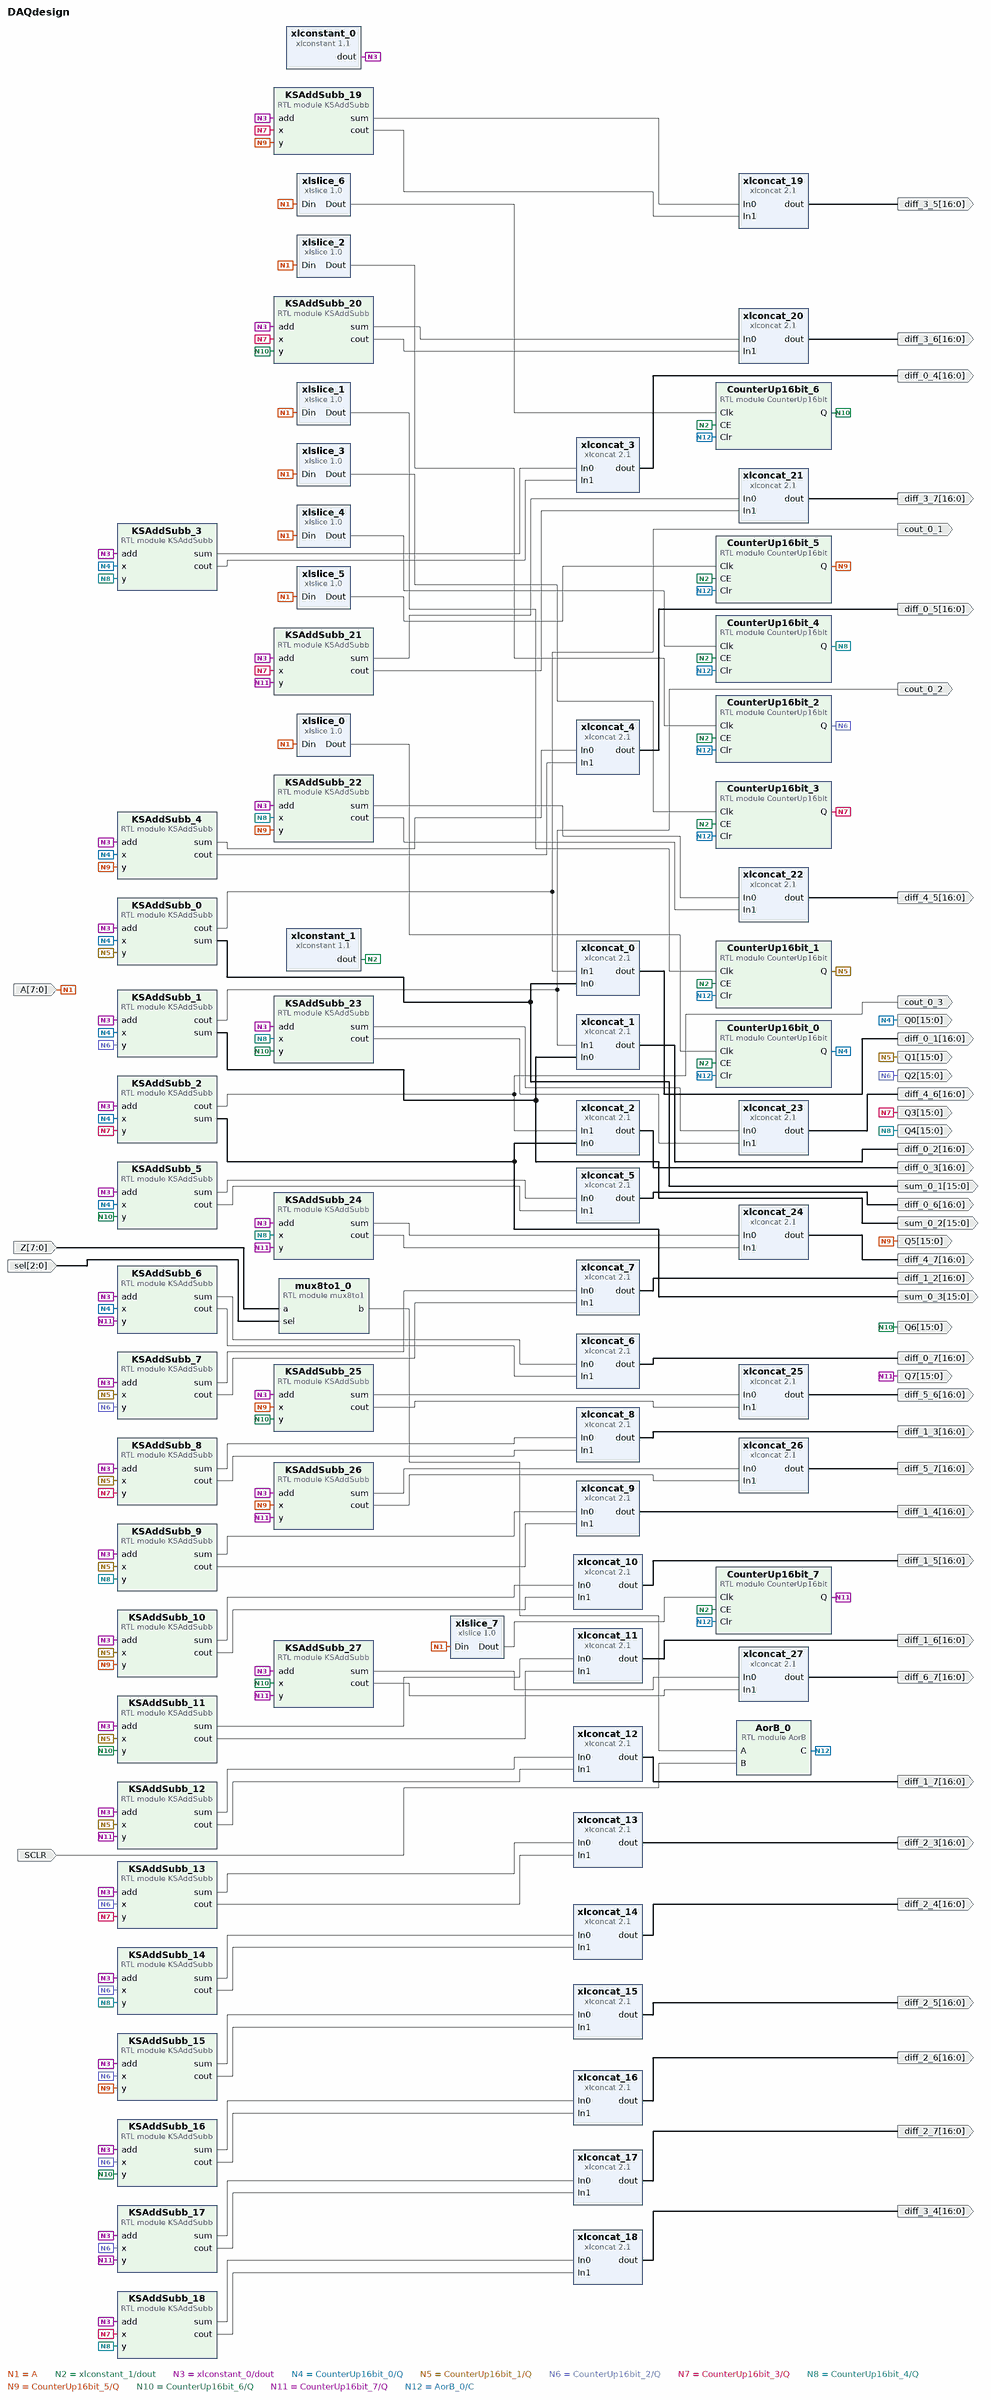
[diagram p0: block diagram of the top level]
# Vivado block design DAQdesign, xc7z020clg400-1, Vivado 2020.1
create_bd_design DAQdesign

create_bd_port -dir O -from 15 -to 0 -type data Q0
create_bd_port -dir O -from 15 -to 0 -type data Q1
create_bd_port -dir O -from 15 -to 0 -type data Q2
create_bd_port -dir O -from 15 -to 0 -type data Q3
create_bd_port -dir I -from 2 -to 0 -type data sel
create_bd_port -dir O -from 15 -to 0 -type data Q4
create_bd_port -dir O -from 15 -to 0 -type data Q5
create_bd_port -dir O -from 15 -to 0 -type data Q6
create_bd_port -dir O -from 15 -to 0 -type data Q7
create_bd_port -dir I -from 7 -to 0 -type rst Z
set_property -dict {CONFIG.POLARITY ACTIVE_HIGH} [get_bd_ports Z]
create_bd_port -dir I -from 7 -to 0 A
create_bd_port -dir O -from 16 -to 0 -type data diff_1_2
create_bd_port -dir O -from 16 -to 0 -type data diff_1_3
create_bd_port -dir O -from 16 -to 0 -type data diff_1_4
create_bd_port -dir O -from 16 -to 0 -type data diff_1_5
create_bd_port -dir O -from 16 -to 0 -type data diff_1_6
create_bd_port -dir O -from 16 -to 0 -type data diff_1_7
create_bd_port -dir O -from 16 -to 0 -type data diff_2_3
create_bd_port -dir O -from 16 -to 0 -type data diff_2_4
create_bd_port -dir O -from 16 -to 0 -type data diff_2_5
create_bd_port -dir O -from 16 -to 0 -type data diff_2_6
create_bd_port -dir O -from 16 -to 0 -type data diff_2_7
create_bd_port -dir O -from 16 -to 0 -type data diff_3_4
create_bd_port -dir O -from 16 -to 0 -type data diff_3_5
create_bd_port -dir O -from 16 -to 0 -type data diff_3_6
create_bd_port -dir O -from 16 -to 0 -type data diff_3_7
create_bd_port -dir O -from 16 -to 0 -type data diff_4_5
create_bd_port -dir O -from 16 -to 0 -type data diff_4_6
create_bd_port -dir O -from 16 -to 0 -type data diff_4_7
create_bd_port -dir O -from 16 -to 0 -type data diff_5_6
create_bd_port -dir O -from 16 -to 0 -type data diff_5_7
create_bd_port -dir O -from 16 -to 0 -type data diff_6_7
create_bd_port -dir O -from 16 -to 0 -type data diff_0_1
create_bd_port -dir O -from 16 -to 0 -type data diff_0_2
create_bd_port -dir O -from 16 -to 0 -type data diff_0_3
create_bd_port -dir O -from 16 -to 0 -type data diff_0_4
create_bd_port -dir O -from 16 -to 0 -type data diff_0_5
create_bd_port -dir O -from 16 -to 0 -type data diff_0_6
create_bd_port -dir O -from 16 -to 0 -type data diff_0_7
create_bd_port -dir I -type rst SCLR
set_property -dict {CONFIG.POLARITY ACTIVE_HIGH} [get_bd_ports SCLR]
create_bd_port -dir O -from 15 -to 0 -type data sum_0_1
create_bd_port -dir O -type data cout_0_1
create_bd_port -dir O -from 15 -to 0 -type data sum_0_2
create_bd_port -dir O -type data cout_0_2
create_bd_port -dir O -from 15 -to 0 -type data sum_0_3
create_bd_port -dir O cout_0_3

create_bd_cell -type ip -vlnv xilinx.com:ip:xlslice:1.0 xlslice_0
set_property -dict {CONFIG.DIN_WIDTH 8} [get_bd_cells xlslice_0]
create_bd_cell -type ip -vlnv xilinx.com:ip:xlslice:1.0 xlslice_4
set_property -dict {CONFIG.DIN_FROM 4 CONFIG.DIN_TO 4 CONFIG.DIN_WIDTH 8 CONFIG.DOUT_WIDTH 1} [get_bd_cells xlslice_4]
create_bd_cell -type ip -vlnv xilinx.com:ip:xlslice:1.0 xlslice_5
set_property -dict {CONFIG.DIN_FROM 5 CONFIG.DIN_TO 5 CONFIG.DIN_WIDTH 8 CONFIG.DOUT_WIDTH 1} [get_bd_cells xlslice_5]
create_bd_cell -type ip -vlnv xilinx.com:ip:xlslice:1.0 xlslice_6
set_property -dict {CONFIG.DIN_FROM 6 CONFIG.DIN_TO 6 CONFIG.DIN_WIDTH 8 CONFIG.DOUT_WIDTH 1} [get_bd_cells xlslice_6]
create_bd_cell -type ip -vlnv xilinx.com:ip:xlslice:1.0 xlslice_7
set_property -dict {CONFIG.DIN_FROM 7 CONFIG.DIN_TO 7 CONFIG.DIN_WIDTH 8 CONFIG.DOUT_WIDTH 1} [get_bd_cells xlslice_7]
create_bd_cell -type module -reference mux8to1 mux8to1_0
create_bd_cell -type ip -vlnv xilinx.com:ip:xlconstant:1.1 xlconstant_0
set_property -dict {CONFIG.CONST_VAL 0b1} [get_bd_cells xlconstant_0]
create_bd_cell -type ip -vlnv xilinx.com:ip:xlslice:1.0 xlslice_3
set_property -dict {CONFIG.DIN_FROM 3 CONFIG.DIN_TO 3 CONFIG.DIN_WIDTH 8 CONFIG.DOUT_WIDTH 1} [get_bd_cells xlslice_3]
create_bd_cell -type ip -vlnv xilinx.com:ip:xlslice:1.0 xlslice_2
set_property -dict {CONFIG.DIN_FROM 2 CONFIG.DIN_TO 2 CONFIG.DIN_WIDTH 8 CONFIG.DOUT_WIDTH 1} [get_bd_cells xlslice_2]
create_bd_cell -type ip -vlnv xilinx.com:ip:xlslice:1.0 xlslice_1
set_property -dict {CONFIG.DIN_FROM 1 CONFIG.DIN_TO 1 CONFIG.DIN_WIDTH 8 CONFIG.DOUT_WIDTH 1} [get_bd_cells xlslice_1]
create_bd_cell -type ip -vlnv xilinx.com:ip:xlconstant:1.1 xlconstant_1
set_property -dict {CONFIG.CONST_VAL 0b0} [get_bd_cells xlconstant_1]
create_bd_cell -type ip -vlnv xilinx.com:ip:xlconcat:2.1 xlconcat_0
set_property -dict {CONFIG.IN0_WIDTH 16 CONFIG.IN1_WIDTH 1} [get_bd_cells xlconcat_0]
create_bd_cell -type ip -vlnv xilinx.com:ip:xlconcat:2.1 xlconcat_1
set_property -dict {CONFIG.IN0_WIDTH 16 CONFIG.IN1_WIDTH 1} [get_bd_cells xlconcat_1]
create_bd_cell -type ip -vlnv xilinx.com:ip:xlconcat:2.1 xlconcat_2
set_property -dict {CONFIG.IN0_WIDTH 16 CONFIG.IN1_WIDTH 1} [get_bd_cells xlconcat_2]
create_bd_cell -type ip -vlnv xilinx.com:ip:xlconcat:2.1 xlconcat_3
set_property -dict {CONFIG.IN0_WIDTH 16 CONFIG.IN1_WIDTH 1} [get_bd_cells xlconcat_3]
create_bd_cell -type ip -vlnv xilinx.com:ip:xlconcat:2.1 xlconcat_4
set_property -dict {CONFIG.IN0_WIDTH 16 CONFIG.IN1_WIDTH 1} [get_bd_cells xlconcat_4]
create_bd_cell -type ip -vlnv xilinx.com:ip:xlconcat:2.1 xlconcat_5
set_property -dict {CONFIG.IN0_WIDTH 16 CONFIG.IN1_WIDTH 1} [get_bd_cells xlconcat_5]
create_bd_cell -type ip -vlnv xilinx.com:ip:xlconcat:2.1 xlconcat_6
set_property -dict {CONFIG.IN0_WIDTH 16 CONFIG.IN1_WIDTH 1} [get_bd_cells xlconcat_6]
create_bd_cell -type ip -vlnv xilinx.com:ip:xlconcat:2.1 xlconcat_7
set_property -dict {CONFIG.IN0_WIDTH 16 CONFIG.IN1_WIDTH 1} [get_bd_cells xlconcat_7]
create_bd_cell -type ip -vlnv xilinx.com:ip:xlconcat:2.1 xlconcat_8
set_property -dict {CONFIG.IN0_WIDTH 16 CONFIG.IN1_WIDTH 1} [get_bd_cells xlconcat_8]
create_bd_cell -type ip -vlnv xilinx.com:ip:xlconcat:2.1 xlconcat_9
set_property -dict {CONFIG.IN0_WIDTH 16 CONFIG.IN1_WIDTH 1} [get_bd_cells xlconcat_9]
create_bd_cell -type ip -vlnv xilinx.com:ip:xlconcat:2.1 xlconcat_10
set_property -dict {CONFIG.IN0_WIDTH 16 CONFIG.IN1_WIDTH 1} [get_bd_cells xlconcat_10]
create_bd_cell -type ip -vlnv xilinx.com:ip:xlconcat:2.1 xlconcat_11
set_property -dict {CONFIG.IN0_WIDTH 16 CONFIG.IN1_WIDTH 1} [get_bd_cells xlconcat_11]
create_bd_cell -type ip -vlnv xilinx.com:ip:xlconcat:2.1 xlconcat_12
set_property -dict {CONFIG.IN0_WIDTH 16 CONFIG.IN1_WIDTH 1} [get_bd_cells xlconcat_12]
create_bd_cell -type ip -vlnv xilinx.com:ip:xlconcat:2.1 xlconcat_13
set_property -dict {CONFIG.IN0_WIDTH 16 CONFIG.IN1_WIDTH 1} [get_bd_cells xlconcat_13]
create_bd_cell -type ip -vlnv xilinx.com:ip:xlconcat:2.1 xlconcat_14
set_property -dict {CONFIG.IN0_WIDTH 16 CONFIG.IN1_WIDTH 1} [get_bd_cells xlconcat_14]
create_bd_cell -type ip -vlnv xilinx.com:ip:xlconcat:2.1 xlconcat_15
set_property -dict {CONFIG.IN0_WIDTH 16 CONFIG.IN1_WIDTH 1} [get_bd_cells xlconcat_15]
create_bd_cell -type ip -vlnv xilinx.com:ip:xlconcat:2.1 xlconcat_16
set_property -dict {CONFIG.IN0_WIDTH 16 CONFIG.IN1_WIDTH 1} [get_bd_cells xlconcat_16]
create_bd_cell -type ip -vlnv xilinx.com:ip:xlconcat:2.1 xlconcat_17
set_property -dict {CONFIG.IN0_WIDTH 16 CONFIG.IN1_WIDTH 1} [get_bd_cells xlconcat_17]
create_bd_cell -type ip -vlnv xilinx.com:ip:xlconcat:2.1 xlconcat_18
set_property -dict {CONFIG.IN0_WIDTH 16 CONFIG.IN1_WIDTH 1} [get_bd_cells xlconcat_18]
create_bd_cell -type ip -vlnv xilinx.com:ip:xlconcat:2.1 xlconcat_19
set_property -dict {CONFIG.IN0_WIDTH 16 CONFIG.IN1_WIDTH 1} [get_bd_cells xlconcat_19]
create_bd_cell -type ip -vlnv xilinx.com:ip:xlconcat:2.1 xlconcat_20
set_property -dict {CONFIG.IN0_WIDTH 16 CONFIG.IN1_WIDTH 1} [get_bd_cells xlconcat_20]
create_bd_cell -type ip -vlnv xilinx.com:ip:xlconcat:2.1 xlconcat_21
set_property -dict {CONFIG.IN0_WIDTH 16 CONFIG.IN1_WIDTH 1} [get_bd_cells xlconcat_21]
create_bd_cell -type ip -vlnv xilinx.com:ip:xlconcat:2.1 xlconcat_22
set_property -dict {CONFIG.IN0_WIDTH 16 CONFIG.IN1_WIDTH 1} [get_bd_cells xlconcat_22]
create_bd_cell -type ip -vlnv xilinx.com:ip:xlconcat:2.1 xlconcat_23
set_property -dict {CONFIG.IN0_WIDTH 16 CONFIG.IN1_WIDTH 1} [get_bd_cells xlconcat_23]
create_bd_cell -type ip -vlnv xilinx.com:ip:xlconcat:2.1 xlconcat_24
set_property -dict {CONFIG.IN0_WIDTH 16 CONFIG.IN1_WIDTH 1} [get_bd_cells xlconcat_24]
create_bd_cell -type ip -vlnv xilinx.com:ip:xlconcat:2.1 xlconcat_25
set_property -dict {CONFIG.IN0_WIDTH 16 CONFIG.IN1_WIDTH 1} [get_bd_cells xlconcat_25]
create_bd_cell -type ip -vlnv xilinx.com:ip:xlconcat:2.1 xlconcat_26
set_property -dict {CONFIG.IN0_WIDTH 16 CONFIG.IN1_WIDTH 1} [get_bd_cells xlconcat_26]
create_bd_cell -type ip -vlnv xilinx.com:ip:xlconcat:2.1 xlconcat_27
set_property -dict {CONFIG.IN0_WIDTH 16 CONFIG.IN1_WIDTH 1} [get_bd_cells xlconcat_27]
create_bd_cell -type module -reference CounterUp16bit CounterUp16bit_0
create_bd_cell -type module -reference CounterUp16bit CounterUp16bit_1
create_bd_cell -type module -reference CounterUp16bit CounterUp16bit_2
create_bd_cell -type module -reference CounterUp16bit CounterUp16bit_3
create_bd_cell -type module -reference CounterUp16bit CounterUp16bit_4
create_bd_cell -type module -reference CounterUp16bit CounterUp16bit_5
create_bd_cell -type module -reference CounterUp16bit CounterUp16bit_6
create_bd_cell -type module -reference CounterUp16bit CounterUp16bit_7
create_bd_cell -type module -reference AorB AorB_0
create_bd_cell -type module -reference KSAddSubb KSAddSubb_0
create_bd_cell -type module -reference KSAddSubb KSAddSubb_13
create_bd_cell -type module -reference KSAddSubb KSAddSubb_14
create_bd_cell -type module -reference KSAddSubb KSAddSubb_15
create_bd_cell -type module -reference KSAddSubb KSAddSubb_16
create_bd_cell -type module -reference KSAddSubb KSAddSubb_17
create_bd_cell -type module -reference KSAddSubb KSAddSubb_18
create_bd_cell -type module -reference KSAddSubb KSAddSubb_19
create_bd_cell -type module -reference KSAddSubb KSAddSubb_20
create_bd_cell -type module -reference KSAddSubb KSAddSubb_21
create_bd_cell -type module -reference KSAddSubb KSAddSubb_1
create_bd_cell -type module -reference KSAddSubb KSAddSubb_22
create_bd_cell -type module -reference KSAddSubb KSAddSubb_23
create_bd_cell -type module -reference KSAddSubb KSAddSubb_24
create_bd_cell -type module -reference KSAddSubb KSAddSubb_25
create_bd_cell -type module -reference KSAddSubb KSAddSubb_26
create_bd_cell -type module -reference KSAddSubb KSAddSubb_27
create_bd_cell -type module -reference KSAddSubb KSAddSubb_2
create_bd_cell -type module -reference KSAddSubb KSAddSubb_3
create_bd_cell -type module -reference KSAddSubb KSAddSubb_4
create_bd_cell -type module -reference KSAddSubb KSAddSubb_5
create_bd_cell -type module -reference KSAddSubb KSAddSubb_6
create_bd_cell -type module -reference KSAddSubb KSAddSubb_7
create_bd_cell -type module -reference KSAddSubb KSAddSubb_8
create_bd_cell -type module -reference KSAddSubb KSAddSubb_9
create_bd_cell -type module -reference KSAddSubb KSAddSubb_10
create_bd_cell -type module -reference KSAddSubb KSAddSubb_11
create_bd_cell -type module -reference KSAddSubb KSAddSubb_12

# ---- connections ----

connect_bd_net -net clk_1 [get_bd_ports A] \
  [get_bd_pins xlslice_0/Din] [get_bd_pins xlslice_4/Din] [get_bd_pins xlslice_5/Din] [get_bd_pins xlslice_6/Din] \
  [get_bd_pins xlslice_7/Din] [get_bd_pins xlslice_3/Din] [get_bd_pins xlslice_2/Din] [get_bd_pins xlslice_1/Din]
connect_bd_net [get_bd_ports Z] [get_bd_pins mux8to1_0/a]
connect_bd_net [get_bd_ports sel] [get_bd_pins mux8to1_0/sel]
connect_bd_net [get_bd_pins xlslice_1/Dout] [get_bd_pins CounterUp16bit_1/Clk]
connect_bd_net [get_bd_pins mux8to1_0/b] [get_bd_pins AorB_0/A]
connect_bd_net [get_bd_pins xlslice_0/Dout] [get_bd_pins CounterUp16bit_0/Clk]
connect_bd_net [get_bd_pins xlslice_2/Dout] [get_bd_pins CounterUp16bit_2/Clk]
connect_bd_net [get_bd_pins xlslice_3/Dout] [get_bd_pins CounterUp16bit_3/Clk]
connect_bd_net [get_bd_pins xlslice_4/Dout] [get_bd_pins CounterUp16bit_4/Clk]
connect_bd_net [get_bd_pins xlslice_5/Dout] [get_bd_pins CounterUp16bit_5/Clk]
connect_bd_net [get_bd_pins xlslice_6/Dout] [get_bd_pins CounterUp16bit_6/Clk]
connect_bd_net [get_bd_pins xlslice_7/Dout] [get_bd_pins CounterUp16bit_7/Clk]
connect_bd_net [get_bd_pins xlconstant_1/dout] \
  [get_bd_pins CounterUp16bit_0/CE] [get_bd_pins CounterUp16bit_1/CE] [get_bd_pins CounterUp16bit_2/CE] \
  [get_bd_pins CounterUp16bit_3/CE] [get_bd_pins CounterUp16bit_4/CE] [get_bd_pins CounterUp16bit_5/CE] \
  [get_bd_pins CounterUp16bit_6/CE] [get_bd_pins CounterUp16bit_7/CE]
connect_bd_net [get_bd_pins xlconstant_0/dout] \
  [get_bd_pins KSAddSubb_0/add] [get_bd_pins KSAddSubb_13/add] [get_bd_pins KSAddSubb_14/add] [get_bd_pins KSAddSubb_15/add] \
  [get_bd_pins KSAddSubb_16/add] [get_bd_pins KSAddSubb_17/add] [get_bd_pins KSAddSubb_18/add] [get_bd_pins KSAddSubb_19/add] \
  [get_bd_pins KSAddSubb_20/add] [get_bd_pins KSAddSubb_21/add] [get_bd_pins KSAddSubb_1/add] [get_bd_pins KSAddSubb_22/add] \
  [get_bd_pins KSAddSubb_23/add] [get_bd_pins KSAddSubb_24/add] [get_bd_pins KSAddSubb_25/add] [get_bd_pins KSAddSubb_26/add] \
  [get_bd_pins KSAddSubb_27/add] [get_bd_pins KSAddSubb_2/add] [get_bd_pins KSAddSubb_3/add] [get_bd_pins KSAddSubb_4/add] \
  [get_bd_pins KSAddSubb_5/add] [get_bd_pins KSAddSubb_6/add] [get_bd_pins KSAddSubb_7/add] [get_bd_pins KSAddSubb_8/add] \
  [get_bd_pins KSAddSubb_9/add] [get_bd_pins KSAddSubb_10/add] [get_bd_pins KSAddSubb_11/add] [get_bd_pins KSAddSubb_12/add]
connect_bd_net [get_bd_pins CounterUp16bit_0/Q] \
  [get_bd_ports Q0] [get_bd_pins KSAddSubb_0/x] [get_bd_pins KSAddSubb_1/x] [get_bd_pins KSAddSubb_2/x] \
  [get_bd_pins KSAddSubb_3/x] [get_bd_pins KSAddSubb_4/x] [get_bd_pins KSAddSubb_5/x] [get_bd_pins KSAddSubb_6/x]
connect_bd_net [get_bd_pins CounterUp16bit_1/Q] \
  [get_bd_ports Q1] [get_bd_pins KSAddSubb_0/y] [get_bd_pins KSAddSubb_7/x] [get_bd_pins KSAddSubb_8/x] \
  [get_bd_pins KSAddSubb_9/x] [get_bd_pins KSAddSubb_10/x] [get_bd_pins KSAddSubb_11/x] [get_bd_pins KSAddSubb_12/x]
connect_bd_net [get_bd_pins CounterUp16bit_2/Q] \
  [get_bd_ports Q2] [get_bd_pins KSAddSubb_13/x] [get_bd_pins KSAddSubb_14/x] [get_bd_pins KSAddSubb_15/x] \
  [get_bd_pins KSAddSubb_16/x] [get_bd_pins KSAddSubb_17/x] [get_bd_pins KSAddSubb_1/y] [get_bd_pins KSAddSubb_7/y]
connect_bd_net [get_bd_pins CounterUp16bit_3/Q] \
  [get_bd_ports Q3] [get_bd_pins KSAddSubb_13/y] [get_bd_pins KSAddSubb_18/x] [get_bd_pins KSAddSubb_19/x] \
  [get_bd_pins KSAddSubb_20/x] [get_bd_pins KSAddSubb_21/x] [get_bd_pins KSAddSubb_2/y] [get_bd_pins KSAddSubb_8/y]
connect_bd_net [get_bd_pins CounterUp16bit_4/Q] \
  [get_bd_ports Q4] [get_bd_pins KSAddSubb_14/y] [get_bd_pins KSAddSubb_18/y] [get_bd_pins KSAddSubb_22/x] \
  [get_bd_pins KSAddSubb_23/x] [get_bd_pins KSAddSubb_24/x] [get_bd_pins KSAddSubb_3/y] [get_bd_pins KSAddSubb_9/y]
connect_bd_net [get_bd_pins CounterUp16bit_5/Q] \
  [get_bd_ports Q5] [get_bd_pins KSAddSubb_15/y] [get_bd_pins KSAddSubb_19/y] [get_bd_pins KSAddSubb_22/y] \
  [get_bd_pins KSAddSubb_25/x] [get_bd_pins KSAddSubb_26/x] [get_bd_pins KSAddSubb_4/y] [get_bd_pins KSAddSubb_10/y]
connect_bd_net [get_bd_pins CounterUp16bit_6/Q] \
  [get_bd_ports Q6] [get_bd_pins KSAddSubb_16/y] [get_bd_pins KSAddSubb_20/y] [get_bd_pins KSAddSubb_23/y] \
  [get_bd_pins KSAddSubb_25/y] [get_bd_pins KSAddSubb_27/x] [get_bd_pins KSAddSubb_5/y] [get_bd_pins KSAddSubb_11/y]
connect_bd_net [get_bd_pins CounterUp16bit_7/Q] \
  [get_bd_ports Q7] [get_bd_pins KSAddSubb_17/y] [get_bd_pins KSAddSubb_21/y] [get_bd_pins KSAddSubb_24/y] \
  [get_bd_pins KSAddSubb_26/y] [get_bd_pins KSAddSubb_27/y] [get_bd_pins KSAddSubb_6/y] [get_bd_pins KSAddSubb_12/y]
connect_bd_net [get_bd_pins xlconcat_7/dout] [get_bd_ports diff_1_2]
connect_bd_net [get_bd_pins xlconcat_8/dout] [get_bd_ports diff_1_3]
connect_bd_net [get_bd_pins xlconcat_9/dout] [get_bd_ports diff_1_4]
connect_bd_net [get_bd_pins xlconcat_10/dout] [get_bd_ports diff_1_5]
connect_bd_net [get_bd_pins xlconcat_11/dout] [get_bd_ports diff_1_6]
connect_bd_net [get_bd_pins xlconcat_12/dout] [get_bd_ports diff_1_7]
connect_bd_net [get_bd_pins xlconcat_13/dout] [get_bd_ports diff_2_3]
connect_bd_net [get_bd_pins xlconcat_14/dout] [get_bd_ports diff_2_4]
connect_bd_net [get_bd_pins xlconcat_15/dout] [get_bd_ports diff_2_5]
connect_bd_net [get_bd_pins xlconcat_16/dout] [get_bd_ports diff_2_6]
connect_bd_net [get_bd_pins xlconcat_17/dout] [get_bd_ports diff_2_7]
connect_bd_net [get_bd_pins xlconcat_18/dout] [get_bd_ports diff_3_4]
connect_bd_net [get_bd_pins xlconcat_19/dout] [get_bd_ports diff_3_5]
connect_bd_net [get_bd_pins xlconcat_20/dout] [get_bd_ports diff_3_6]
connect_bd_net [get_bd_pins xlconcat_21/dout] [get_bd_ports diff_3_7]
connect_bd_net [get_bd_pins xlconcat_22/dout] [get_bd_ports diff_4_5]
connect_bd_net [get_bd_pins xlconcat_23/dout] [get_bd_ports diff_4_6]
connect_bd_net [get_bd_pins xlconcat_24/dout] [get_bd_ports diff_4_7]
connect_bd_net [get_bd_pins xlconcat_25/dout] [get_bd_ports diff_5_6]
connect_bd_net [get_bd_pins xlconcat_26/dout] [get_bd_ports diff_5_7]
connect_bd_net [get_bd_pins xlconcat_27/dout] [get_bd_ports diff_6_7]
connect_bd_net [get_bd_pins xlconcat_0/dout] [get_bd_ports diff_0_1]
connect_bd_net [get_bd_pins xlconcat_1/dout] [get_bd_ports diff_0_2]
connect_bd_net [get_bd_pins xlconcat_2/dout] [get_bd_ports diff_0_3]
connect_bd_net [get_bd_pins xlconcat_3/dout] [get_bd_ports diff_0_4]
connect_bd_net [get_bd_pins xlconcat_4/dout] [get_bd_ports diff_0_5]
connect_bd_net [get_bd_pins xlconcat_5/dout] [get_bd_ports diff_0_6]
connect_bd_net [get_bd_pins xlconcat_6/dout] [get_bd_ports diff_0_7]
connect_bd_net [get_bd_pins AorB_0/C] \
  [get_bd_pins CounterUp16bit_7/Clr] [get_bd_pins CounterUp16bit_6/Clr] [get_bd_pins CounterUp16bit_5/Clr] \
  [get_bd_pins CounterUp16bit_4/Clr] [get_bd_pins CounterUp16bit_3/Clr] [get_bd_pins CounterUp16bit_2/Clr] \
  [get_bd_pins CounterUp16bit_1/Clr] [get_bd_pins CounterUp16bit_0/Clr]
connect_bd_net [get_bd_ports SCLR] [get_bd_pins AorB_0/B]
connect_bd_net [get_bd_pins KSAddSubb_0/sum] [get_bd_pins xlconcat_0/In0] [get_bd_ports sum_0_1]
connect_bd_net [get_bd_pins KSAddSubb_0/cout] [get_bd_pins xlconcat_0/In1] [get_bd_ports cout_0_1]
connect_bd_net [get_bd_pins KSAddSubb_1/sum] [get_bd_pins xlconcat_1/In0] [get_bd_ports sum_0_2]
connect_bd_net [get_bd_pins KSAddSubb_1/cout] [get_bd_pins xlconcat_1/In1] [get_bd_ports cout_0_2]
connect_bd_net [get_bd_pins KSAddSubb_2/sum] [get_bd_pins xlconcat_2/In0] [get_bd_ports sum_0_3]
connect_bd_net [get_bd_pins KSAddSubb_2/cout] [get_bd_pins xlconcat_2/In1] [get_bd_ports cout_0_3]
connect_bd_net [get_bd_pins KSAddSubb_3/sum] [get_bd_pins xlconcat_3/In0]
connect_bd_net [get_bd_pins KSAddSubb_3/cout] [get_bd_pins xlconcat_3/In1]
connect_bd_net [get_bd_pins KSAddSubb_4/sum] [get_bd_pins xlconcat_4/In0]
connect_bd_net [get_bd_pins KSAddSubb_4/cout] [get_bd_pins xlconcat_4/In1]
connect_bd_net [get_bd_pins KSAddSubb_5/sum] [get_bd_pins xlconcat_5/In0]
connect_bd_net [get_bd_pins KSAddSubb_5/cout] [get_bd_pins xlconcat_5/In1]
connect_bd_net [get_bd_pins KSAddSubb_6/sum] [get_bd_pins xlconcat_6/In0]
connect_bd_net [get_bd_pins KSAddSubb_6/cout] [get_bd_pins xlconcat_6/In1]
connect_bd_net [get_bd_pins KSAddSubb_7/sum] [get_bd_pins xlconcat_7/In0]
connect_bd_net [get_bd_pins KSAddSubb_7/cout] [get_bd_pins xlconcat_7/In1]
connect_bd_net [get_bd_pins KSAddSubb_8/sum] [get_bd_pins xlconcat_8/In0]
connect_bd_net [get_bd_pins KSAddSubb_8/cout] [get_bd_pins xlconcat_8/In1]
connect_bd_net [get_bd_pins KSAddSubb_9/sum] [get_bd_pins xlconcat_9/In0]
connect_bd_net [get_bd_pins KSAddSubb_9/cout] [get_bd_pins xlconcat_9/In1]
connect_bd_net [get_bd_pins KSAddSubb_10/sum] [get_bd_pins xlconcat_10/In0]
connect_bd_net [get_bd_pins KSAddSubb_10/cout] [get_bd_pins xlconcat_10/In1]
connect_bd_net [get_bd_pins KSAddSubb_11/sum] [get_bd_pins xlconcat_11/In0]
connect_bd_net [get_bd_pins KSAddSubb_11/cout] [get_bd_pins xlconcat_11/In1]
connect_bd_net [get_bd_pins KSAddSubb_12/sum] [get_bd_pins xlconcat_12/In0]
connect_bd_net [get_bd_pins KSAddSubb_12/cout] [get_bd_pins xlconcat_12/In1]
connect_bd_net [get_bd_pins KSAddSubb_13/sum] [get_bd_pins xlconcat_13/In0]
connect_bd_net [get_bd_pins KSAddSubb_13/cout] [get_bd_pins xlconcat_13/In1]
connect_bd_net [get_bd_pins KSAddSubb_14/sum] [get_bd_pins xlconcat_14/In0]
connect_bd_net [get_bd_pins KSAddSubb_14/cout] [get_bd_pins xlconcat_14/In1]
connect_bd_net [get_bd_pins KSAddSubb_15/sum] [get_bd_pins xlconcat_15/In0]
connect_bd_net [get_bd_pins KSAddSubb_15/cout] [get_bd_pins xlconcat_15/In1]
connect_bd_net [get_bd_pins KSAddSubb_16/sum] [get_bd_pins xlconcat_16/In0]
connect_bd_net [get_bd_pins KSAddSubb_16/cout] [get_bd_pins xlconcat_16/In1]
connect_bd_net [get_bd_pins KSAddSubb_17/sum] [get_bd_pins xlconcat_17/In0]
connect_bd_net [get_bd_pins KSAddSubb_17/cout] [get_bd_pins xlconcat_17/In1]
connect_bd_net [get_bd_pins KSAddSubb_18/sum] [get_bd_pins xlconcat_18/In0]
connect_bd_net [get_bd_pins KSAddSubb_18/cout] [get_bd_pins xlconcat_18/In1]
connect_bd_net [get_bd_pins KSAddSubb_19/sum] [get_bd_pins xlconcat_19/In0]
connect_bd_net [get_bd_pins KSAddSubb_19/cout] [get_bd_pins xlconcat_19/In1]
connect_bd_net [get_bd_pins KSAddSubb_20/sum] [get_bd_pins xlconcat_20/In0]
connect_bd_net [get_bd_pins KSAddSubb_20/cout] [get_bd_pins xlconcat_20/In1]
connect_bd_net [get_bd_pins KSAddSubb_21/sum] [get_bd_pins xlconcat_21/In0]
connect_bd_net [get_bd_pins KSAddSubb_21/cout] [get_bd_pins xlconcat_21/In1]
connect_bd_net [get_bd_pins KSAddSubb_22/sum] [get_bd_pins xlconcat_22/In0]
connect_bd_net [get_bd_pins KSAddSubb_22/cout] [get_bd_pins xlconcat_22/In1]
connect_bd_net [get_bd_pins KSAddSubb_23/sum] [get_bd_pins xlconcat_23/In0]
connect_bd_net [get_bd_pins KSAddSubb_23/cout] [get_bd_pins xlconcat_23/In1]
connect_bd_net [get_bd_pins KSAddSubb_24/sum] [get_bd_pins xlconcat_24/In0]
connect_bd_net [get_bd_pins KSAddSubb_24/cout] [get_bd_pins xlconcat_24/In1]
connect_bd_net [get_bd_pins KSAddSubb_25/sum] [get_bd_pins xlconcat_25/In0]
connect_bd_net [get_bd_pins KSAddSubb_25/cout] [get_bd_pins xlconcat_25/In1]
connect_bd_net [get_bd_pins KSAddSubb_26/sum] [get_bd_pins xlconcat_26/In0]
connect_bd_net [get_bd_pins KSAddSubb_26/cout] [get_bd_pins xlconcat_26/In1]
connect_bd_net [get_bd_pins KSAddSubb_27/sum] [get_bd_pins xlconcat_27/In0]
connect_bd_net [get_bd_pins KSAddSubb_27/cout] [get_bd_pins xlconcat_27/In1]

validate_bd_design
save_bd_design
